# Altium schematic sheet CH32F207&V307V-R3-2v0.SchDoc
size A2
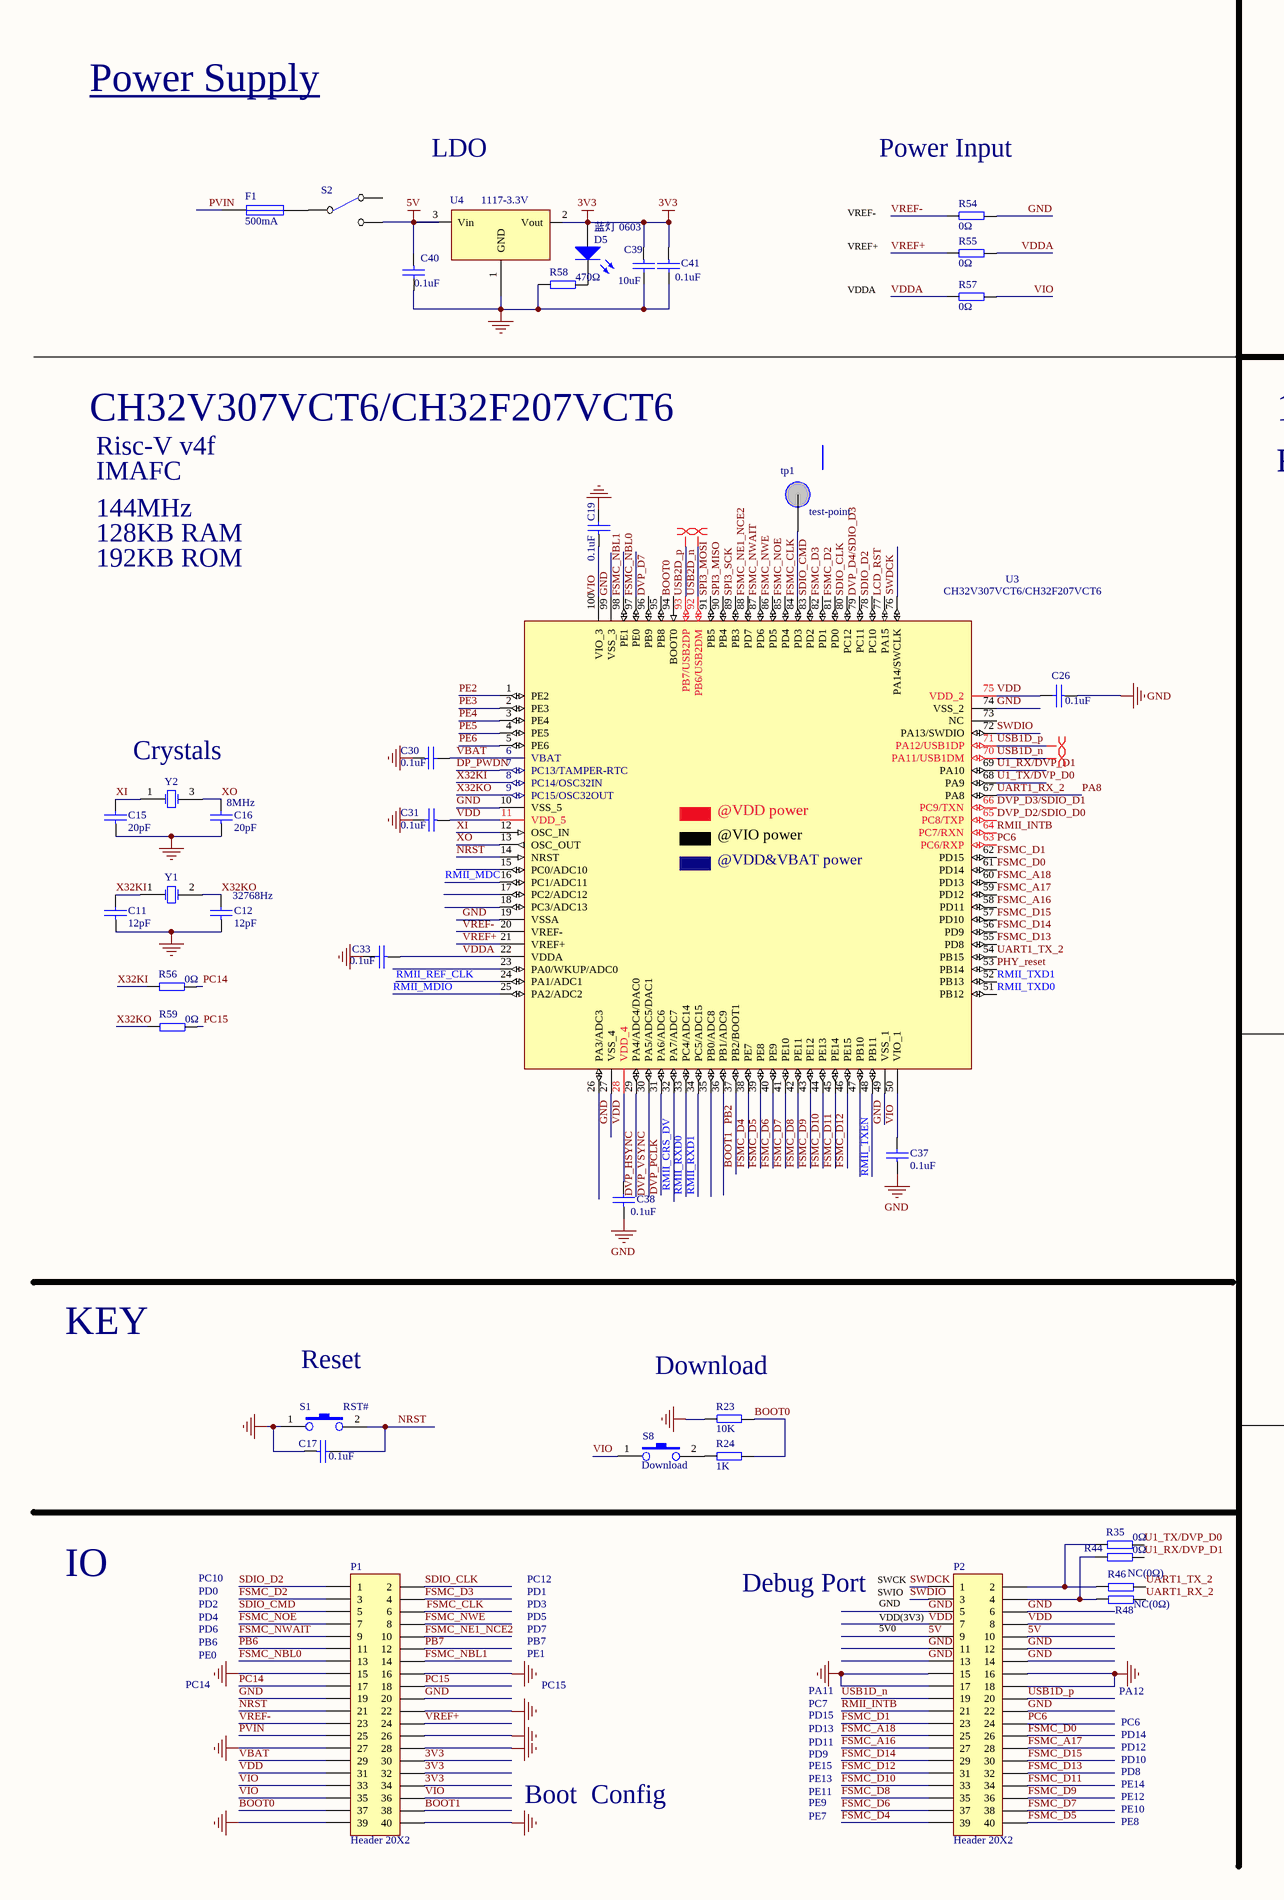
[diagram p0: CH32F207&V307V-R3-2v0.SchDoc, left]
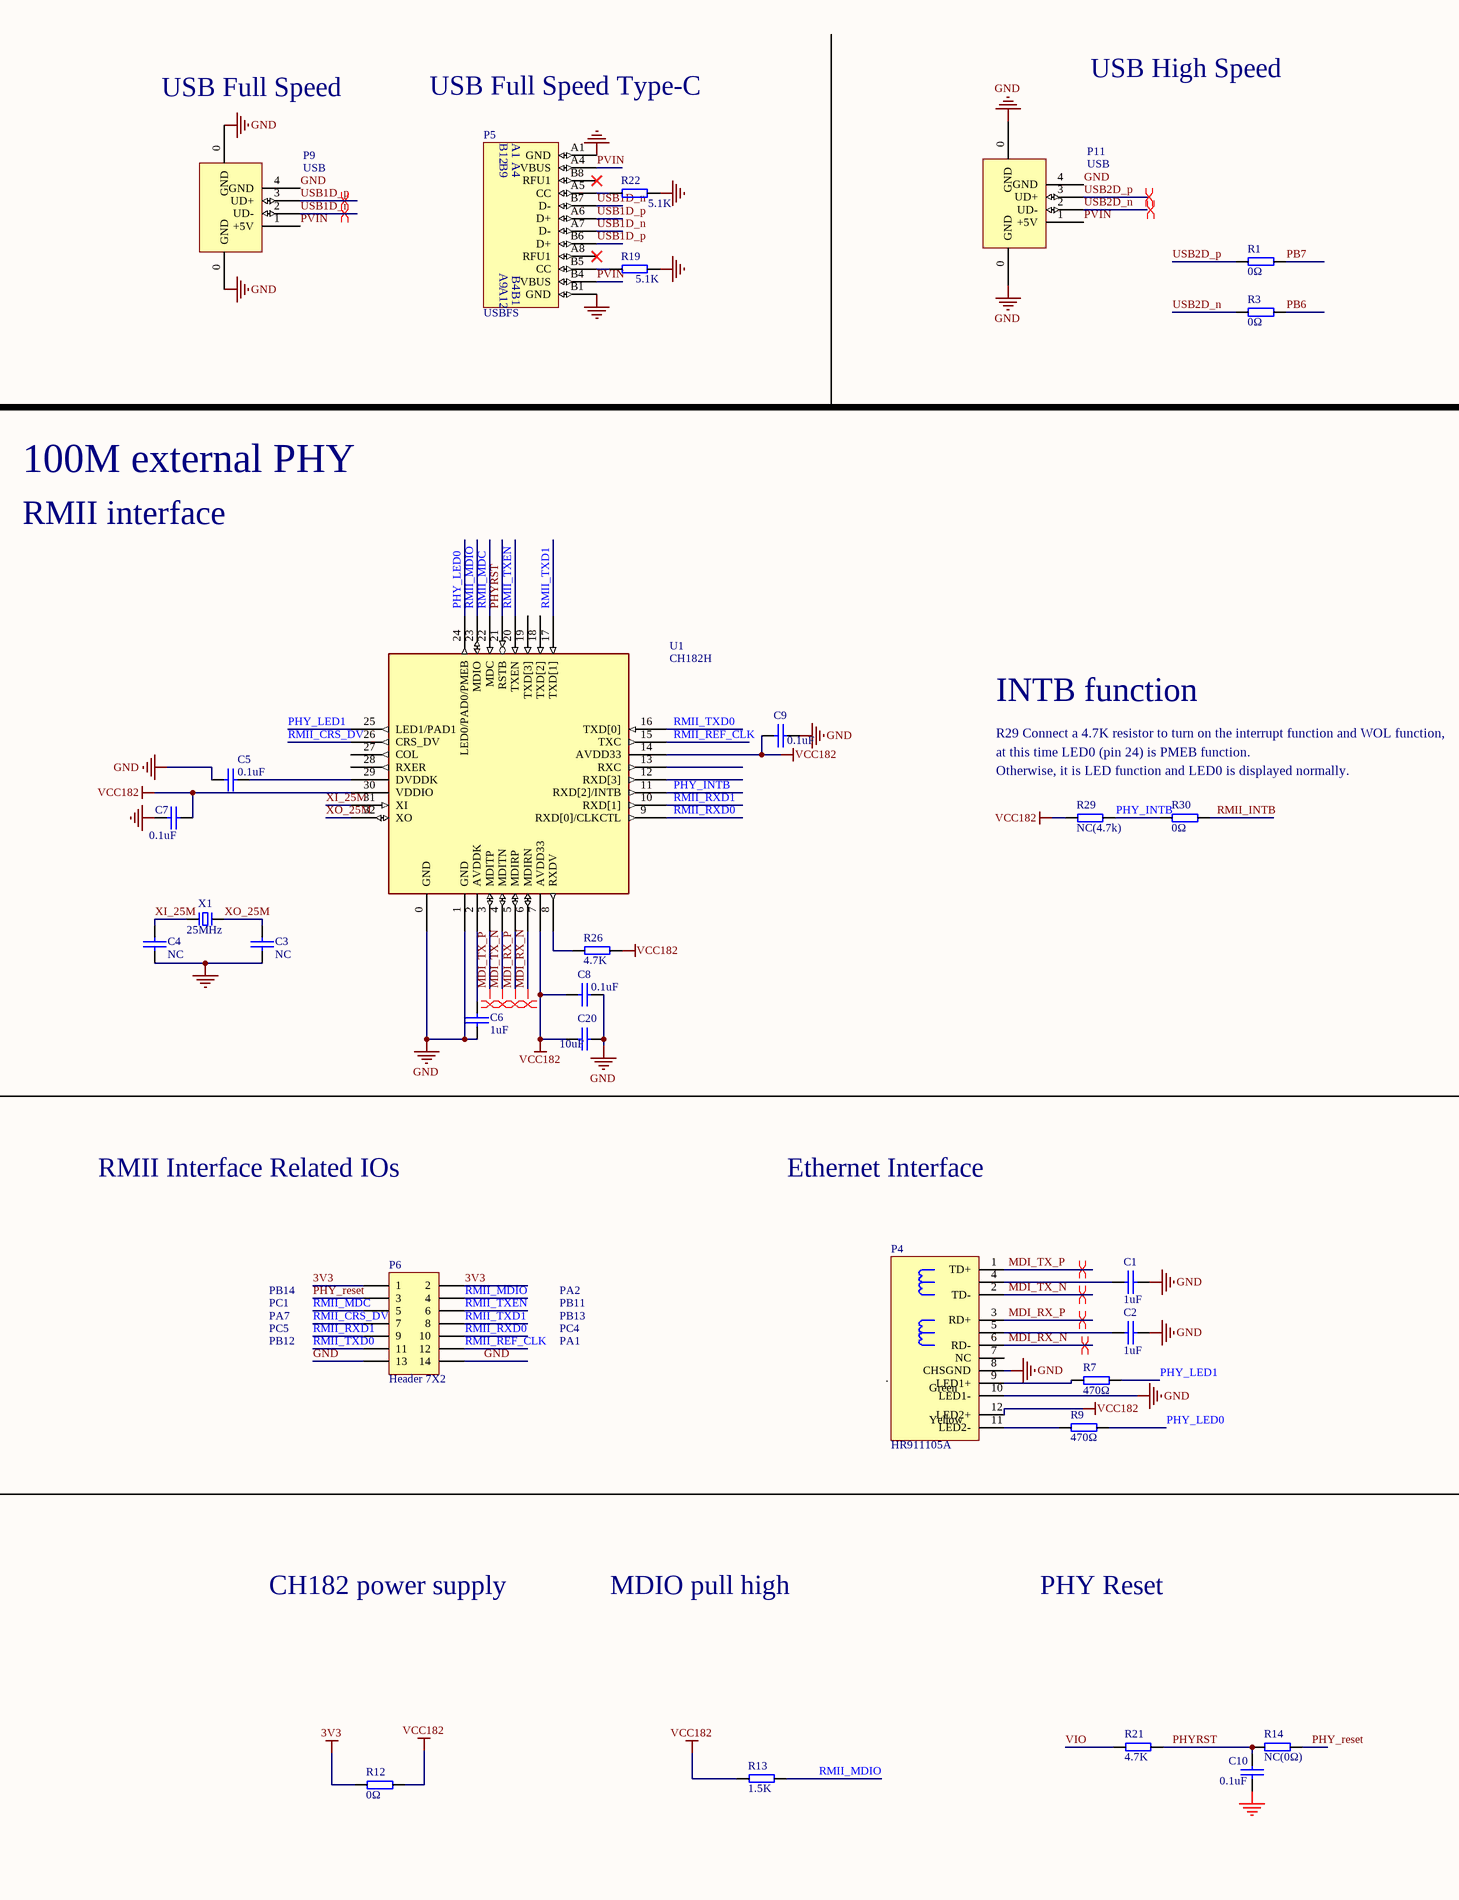
[diagram p1: CH32F207&V307V-R3-2v0.SchDoc, right]

## Parts
C1  1uF  [0603_C]
C2  1uF  [0603_C]
C3  NC  [0603_C]
C4  NC  [0603_C]
C5  0.1uF  [0603_C]
C6  1uF  [0603_C]
C7  0.1uF  [0603_C]
C8  0.1uF  [0603_C]
C9  0.1uF  [0603_C]
C10  0.1uF  [0603_C]
C11  12pF  [0603_C]
C12  12pF  [0603_C]
C15  20pF  [0603_C]
C16  20pF  [0603_C]
C17  0.1uF  [0603_C]
C19  0.1uF  [0603_C]
C20  10uF  [0603_C]
C26  0.1uF  [0603_C]
C30  0.1uF  [0603_C]
C31  0.1uF  [0603_C]
C33  0.1uF  [0603_C]
C37  0.1uF  [0603_C]
C38  0.1uF  [0603_C]
C39  10uF  [0603_C]
C40  0.1uF  [0603_C]
C41  0.1uF  [0603_C]
D5  蓝灯 0603  [0603_LED_S1]
F1  500mA  [0805]
P1  Header 20X2  [HDR2X20]
P2  Header 20X2  [HDR2X20]
P4  HR911105A  [HR911105A]
P5  USBFS  [TYPE-C-Receptacle-2.0]
P6  Header 7X2  [IDC14-2.54mm]
P9  USB  [USBAF]
P11  USB  [USBAF]
R1  0Ω  [0603]
R3  0Ω  [0603]
R7  470Ω  [0603]
R9  470Ω  [0603]
R12  0Ω  [0603]
R13  1.5K  [0603]
R14  NC(0Ω)  [0603]
R19  5.1K  [0603]
R21  4.7K  [0603]
R22  5.1K  [0603]
R23  10K  [0603]
R24  1K  [0603]
R26  4.7K  [0603]
R29  NC(4.7k)  [0603]
R30  0Ω  [0603]
R35  0Ω  [0603]
R44  0Ω  [0603]
R46  NC(0Ω)  [0603]
R48  NC(0Ω)  [0603]
R54  0Ω  [0603]
R55  0Ω  [0603]
R56  0Ω  [0603]
R57  0Ω  [0603]
R58  470Ω  [0603]
R59  0Ω  [0603]
S1  RST#  [SMD_6.1x3.65x2.5mm-KEY]
S2  SW SPDT  [Horizontal Slide Switch_8.7x4.4mm-2D]  (value not drawn)
S8  Download  [SMD_6.1x3.65x2.5mm-KEY]
tp1  test-point  [POINT]
U1  CH182H  [QFN32_5X5]
U3  CH32V307VCT6/CH32F207VCT6  [LQFP100]
U4  1117-3.3V  [SOT-223]
X1  25MHz  [SMD-3225_4P]
Y1  32768Hz  [FC-135]
Y2  8MHz  [SMD-3225_4P]

## Nets
3V3: C39.1 C41.1 D5.A P1.30 P1.32 P1.34 P6.1 P6.2 R12.2 U4.2(Vout)
5V: C40.1 P2.9 P2.10 S2.2(NC) U4.3(Vin)
GND: C1.1 C2.1 C3.1 C4.1 C5.1 C6.1 C7.1 C8.1 C9.1 C10.1 C11.1 C12.1 C15.1 C16.1 C17.1 C19.2 C20.1 C26.1 C30.1 C31.2 C33.2 C37.1 C38.1 C39.2 C40.2 C41.2 P1.15 P1.16 P1.19 P1.20 P1.22 P1.26 P1.27 P1.28 P1.39 P1.40 P2.5 P2.6 P2.11 P2.12 P2.13 P2.14 P2.15 P2.16 P2.17 P2.18 P2.22 P4.8(CHSGND) P4.10(LED1-) P5.A1(GND) P5.B1(GND) P6.13 P6.14 P9.0(GND) P9.4(GND) P11.0(GND) P11.4(GND) R19.2 R22.2 R23.2 R54.1 R58.1 S1.1 U1.0(GND) U1.1(GND) U3.10(VSS_5) U3.19(VSSA) U3.27(VSS_4) U3.49(VSS_1) U3.74(VSS_2) U3.99(VSS_3) U4.1(GND)
VCC182: C7.2 C8.2 C9.2 C20.2 P4.12(LED2+) R12.1 R13.1 R26.1 R29.2 U1.7(AVDD33) U1.14(AVDD33) U1.30(VDDIO)
BOOT0: P1.37 R23.1 R24.1 U3.94(BOOT0)
BOOT1: P1.38 U3.37(PB2/BOOT1)  [also labelled PB2]
DP_PWDN: U3.7(PC13/TAMPER-RTC)
DVP_D2/SDIO_D0: U3.65(PC8/TXP)
DVP_D3/SDIO_D1: U3.66(PC9/TXN)
DVP_D4/SDIO_D3: U3.79(PC11)
DVP_D7: U3.96(PB9)
DVP_HSYNC: U3.29(PA4/ADC4/DAC0)
DVP_PCLK: U3.31(PA6/ADC6)
DVP_VSYNC: U3.30(PA5/ADC5/DAC1)
FSMC_A16: P2.27 U3.58(PD11)
FSMC_A17: P2.28 U3.59(PD12)
FSMC_A18: P2.25 U3.60(PD13)
FSMC_CLK: P1.6 tp1.1(point) U3.84(PD3)
FSMC_D0: P2.26 U3.61(PD14)
FSMC_D1: P2.23 U3.62(PD15)
FSMC_D2: P1.3 U3.81(PD0)
FSMC_D3: P1.4 U3.82(PD1)
FSMC_D4: P2.39 U3.38(PE7)
FSMC_D5: P2.40 U3.39(PE8)
FSMC_D6: P2.37 U3.40(PE9)
FSMC_D7: P2.38 U3.41(PE10)
FSMC_D8: P2.35 U3.42(PE11)
FSMC_D9: P2.36 U3.43(PE12)
FSMC_D10: P2.33 U3.44(PE13)
FSMC_D11: P2.34 U3.45(PE14)
FSMC_D12: P2.31 U3.46(PE15)
FSMC_D13: P2.32 U3.55(PD8)
FSMC_D14: P2.29 U3.56(PD9)
FSMC_D15: P2.30 U3.57(PD10)
FSMC_NBL0: P1.13 U3.97(PE0)
FSMC_NBL1: P1.14 U3.98(PE1)
FSMC_NE1_NCE2: P1.10 U3.88(PD7)
FSMC_NOE: P1.7 U3.85(PD4)
FSMC_NWAIT: P1.9 U3.87(PD6)
FSMC_NWE: P1.8 U3.86(PD5)
LCD_RST: U3.77(PA15)
MDI_RX_N: P4.6(RD-) U1.6(MDIRN)
MDI_RX_P: P4.3(RD+) U1.5(MDIRP)
MDI_TX_N: P4.2(TD-) U1.4(MDITN)
MDI_TX_P: P4.1(TD+) U1.3(MDITP)
NRST: C17.2 P1.21 S1.2 U3.14(NRST)
PA8: R48.2 U3.67(PA8)  [also labelled UART1_RX_2]
PB6: P1.11 R3.2
PB7: P1.12 R1.2
PC6: P2.24 U3.63(PC6/RXP)
PC14: P1.17 R56.2
PC15: P1.18 R59.2
PE2: U3.1(PE2)
PE3: U3.2(PE3)
PE4: U3.3(PE4)
PE5: U3.4(PE5)
PE6: U3.5(PE6)
PHY_INTB: R29.1 R30.1 U1.11(RXD[2]/INTB)
PHY_LED0: R9.2 U1.24(LED0/PAD0/PMEB)
PHY_LED1: R7.2 U1.25(LED1/PAD1)
PHY_reset: P6.3 R14.2 U3.53(PB14)
PHYRST: C10.2 R14.1 R21.1 U1.21(RSTB)
PVIN: F1.1 P1.25 P5.A4(VBUS) P5.B4(VBUS) P9.1(+5V) P11.1(+5V)
RMII_CRS_DV: P6.7 U1.26(CRS_DV) U3.32(PA7/ADC7)
RMII_INTB: P2.21 R30.2 U3.64(PC7/RXN)
RMII_MDC: P6.5 U1.22(MDC) U3.16(PC1/ADC11)
RMII_MDIO: P6.4 R13.2 U1.23(MDIO) U3.25(PA2/ADC2)
RMII_REF_CLK: P6.12 U1.15(TXC) U3.24(PA1/ADC1)
RMII_RXD0: P6.10 U1.9(RXD[0]/CLKCTL) U3.33(PC4/ADC14)
RMII_RXD1: P6.9 U1.10(RXD[1]) U3.34(PC5/ADC15)
RMII_TXD0: P6.11 U1.16(TXD[0]) U3.51(PB12)
RMII_TXD1: P6.8 U1.17(TXD[1]) U3.52(PB13)
RMII_TXEN: P6.6 U1.20(TXEN) U3.48(PB11)
SDIO_CLK: P1.2 U3.80(PC12)
SDIO_CMD: P1.5 U3.83(PD2)
SDIO_D2: P1.1 U3.78(PC10)
SPI3_MISO: U3.90(PB4)
SPI3_MOSI: U3.91(PB5)
SPI3_SCK: U3.89(PB3)
SWDCK: P2.1 U3.76(PA14/SWCLK)
SWDIO: P2.3 U3.72(PA13/SWDIO)
U1_RX/DVP_D1: R44.2 U3.69(PA10)
U1_TX/DVP_D0: R35.2 U3.68(PA9)
UART1_TX_2: R46.2 U3.54(PB15)
USB1D_n: P2.19 P5.A7(D-) P5.B7(D-) P9.2(UD-) U3.70(PA11/USB1DM)
USB1D_p: P2.20 P5.A6(D+) P5.B6(D+) P9.3(UD+) U3.71(PA12/USB1DP)
USB2D_n: P11.2(UD-) R3.1 U3.92(PB6/USB2DM)
USB2D_p: P11.3(UD+) R1.1 U3.93(PB7/USB2DP)
VBAT: C30.2 P1.29 U3.6(VBAT)
VDD: C26.2 C31.1 C38.2 P1.31 P2.7 P2.8 U3.11(VDD_5) U3.28(VDD_4) U3.75(VDD_2)
VDDA: C33.1 R55.1 R57.2 U3.22(VDDA)
VIO: C19.1 C37.2 P1.33 P1.35 P1.36 R21.2 R57.1 S8.1 U3.50(VIO_1) U3.100(VIO_3)
VREF+: P1.24 R55.2 U3.21(VREF+)
VREF-: P1.23 R54.2 U3.20(VREF-)
X32KI: C11.2 R56.1 U3.8(PC14/OSC32IN) Y1.1(OSC1)
X32KO: C12.2 R59.1 U3.9(PC15/OSC32OUT) Y1.2(OSC2)
XI: C15.2 U3.12(OSC_IN) Y2.1(OSC1)
XI_25M: C4.2 U1.31(XI) X1.1
XO: C16.2 U3.13(OSC_OUT) Y2.3(OSC2)
XO_25M: C3.2 U1.32(XO) X1.3
NetC1_2: C1.2 P4.4
NetC2_2: C2.2 P4.5
NetC5_2: C5.2 U1.29(DVDDK)
NetC6_2: C6.2 U1.2(AVDDK)
NetD5_K: D5.K R58.2
NetF1_2: F1.2 S2.1(COMMON)
NetP2_2: P2.2 R35.1 R46.1
NetP2_4: P2.4 R44.1 R48.1
NetP4_9: P4.9(LED1+) R7.1
NetP4_11: P4.11(LED2-) R9.1
NetP5_A5: P5.A5(CC) R22.1
NetP5_B5: P5.B5(CC) R19.1
NetR24_2: R24.2 S8.2
NetR26_2: R26.2 U1.8(RXDV)

Not connected (* = marked no-connect by the designer): P4 7(NC); P5 A8(RFU1)* B8(RFU1)*; S2 3(NO); U1 12(RXD[3]) 13(RXC) 18(TXD[2]) 19(TXD[3]) 27(COL) 28(RXER); U3 15(PC0/ADC10) 17(PC2/ADC12) 18(PC3/ADC13) 23(PA0/WKUP/ADC0) 26(PA3/ADC3) 35(PB0/ADC8) 36(PB1/ADC9) 47(PB10) 73(NC) 95(PB8)

## Layout directives
differential pair: MDI_RX_N, MDI_RX_P, MDI_TX_N, MDI_TX_P, USB1D_n, USB1D_p, USB2D_n, USB2D_p

## Notes on the sheet
- USB Full Speed
- USB Full Speed Type-C
- USB High Speed
- Power Supply <Power supply>
- LDO
- Power Input
- VREF-
- VREF+
- VDDA
- CH32V307VCT6/CH32F207VCT6
- 100M external PHY
- Risc-V v4f
- IMAFC
- RMII interface
- 144MHz
- 128KB RAM
- 192KB ROM
- INTB function
- R29 Connect a 4.7K resistor to turn on the interrupt function and WOL function,
- at this time LED0 (pin 24) is PMEB function.
- Otherwise, it is LED function and LED0 is displayed normally.
- Crystals
- RMII Interface Related IOs
- Ethernet Interface
- PC1
- PB14
- PA2
- PB11
- PC5
- PB12
- PA7
- PC4
- PB13
- PA1
- KEY
- Reset
- (near R23) Download
- CH182 power supply
- MDIO pull high
- PHY Reset
- IO
- PC10
- PD2
- PD0
- PD5
- PD3
- PD1
- PC12
- Debug Port
- SWCK
- SWIO
- GND
- PD4
- PD6
- PB6
- PE0
- PE1
- PB7
- PD7
- (near P2) VDD(3V3)
- 5V0
- PC14
- PC15
- PA11
- PC7
- PD15
- PD13
- PA12
- PD14
- PC6
- Boot  Config
- PD11
- PD9
- PE15
- PE13
- PE11
- PE9
- PE12
- PE14
- PD8
- PD10
- PD12
- PE7
- PE8
- PE10
- (in symbol CH32V307V) @VDD power; @VIO power; @VDD&VBAT power
- (in symbol HR911105A_1) Green; Yellow
- (in symbol TYPE-C1) B12; B9; A9; A12

## Library data of the parts
C1-C12 C15-C17 C19 C20 C26 C30 C31 C33 C37-C41 = CAP: Capacitor
D5 = 0603 蓝灯: 发光二极管; ComponentLink1Description: 供应商链接; ComponentLink1URL: http://www.szlcsc.com/product/details_73150.html; Package: 0603; Supplier: LC; SuppliersPartNumber: C72041
F1 = Fuse 1: Fuse; Published: 8-Jun-2000; LatestRevisionDate: 17-Jul-2002; LatestRevisionNote: Re-released for DXP Platform.; PackageReference: PIN-W2/E2.8; Publisher: Altium Limited; PackageDescription: Thru-Hole; 2 Leads
P1 P2 = Header 20X2: Header, 20-Pin, Dual row; LatestRevisionDate: 17-Jul-2002; LatestRevisionNote: Re-released for DXP Platform.; Publisher: Altium Limited
P4 = HR911105A_1
P5 = TYPE-C1
P6 = Header 7X2: Header, 7-Pin, Dual row; LatestRevisionDate: 17-Jul-2002; LatestRevisionNote: Re-released for DXP Platform.; Publisher: Altium Limited
P9 P11 = USB: USB Port
R1 R3 R7 R9 R12-R14 R19 R21-R24 R26 R29 R30 R35 R44 R46 R48 R54-R59 = RES
S1 S8 = KEY1
tp1 = test-point: 测试点
U1 = CH182H: MII/RMII 10/100M Ethernet PHY (Transceiver) with auto MDIX
U3 = CH32V307V: RISC-V FPU HD-MCU, 144MHz, USB_480M, USB OTG, 1000M Ethernet MAC, 2*CAN, FSMC+DVP
X1 = XTAL-2P: 2脚无源脚晶振
Y1 Y2 = XTAL: Crystal Oscillator; Published: 8-Jun-2000; LatestRevisionDate: 17-Jul-2002; LatestRevisionNote: Re-released for DXP Platform.; PackageReference: R38; Publisher: Altium Limited; PackageDescription: Crystal, Thru-Hole; 2 Leads; Body 3.1 x 8.2 mm (Dia.xH)